# Altium project usb2can.PrjPcb
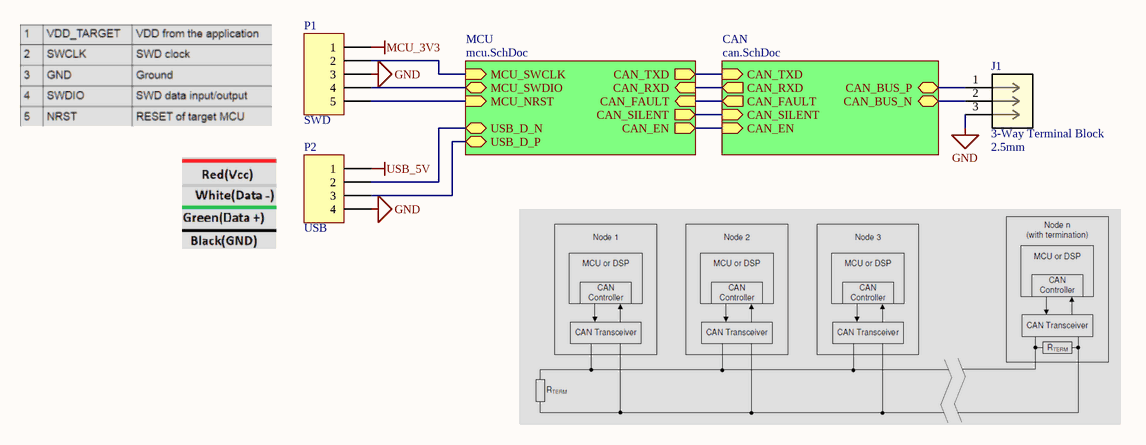
[diagram p0: top.SchDoc]
3 sheets, 36 parts. Net scope: hierarchical (ports join the sheet entries above them; power ports are global).
Board file: pcb.PcbDoc
Sheets:
  top.SchDoc
    CAN = can.SchDoc
    MCU = mcu.SchDoc

## Sheet top.SchDoc
size A4; SheetNumber: 1; SheetTotal: 3

### Parts
J1  3-Way Terminal Block  value 2.5mm  [TERMINAL_BLOCK_2.5MM_3WAY]
P1  Pin Header 5  [PIN_HEADER_1X5]  (value not drawn)
P2  Pin Header 4  [PIN_HEADER_1X4]  (value not drawn)

### Sub-sheets
CAN = can.SchDoc: CAN_TXD (in), CAN_RXD (out), CAN_FAULT (out), CAN_SILENT (in), CAN_EN (in), CAN_BUS_P (bidir), CAN_BUS_N (bidir)
MCU = mcu.SchDoc: USB_D_P (bidir), USB_D_N (bidir), MCU_SWCLK (in), MCU_SWDIO (bidir), CAN_TXD (out), CAN_SILENT (out), CAN_RXD (in), CAN_FAULT (in), CAN_EN (out), MCU_NRST (in)

### Nets
GND: J1.3 P1.3 P2.4
MCU_3V3: P1.1
USB_5V: P2.1
CAN_BUS_N: J1.2 ; sheet CAN/CAN_BUS_N
CAN_BUS_P: J1.1 ; sheet CAN/CAN_BUS_P
CAN_EN: sheet CAN/CAN_EN, sheet MCU/CAN_EN
CAN_FAULT: sheet CAN/CAN_FAULT, sheet MCU/CAN_FAULT
CAN_RXD: sheet CAN/CAN_RXD, sheet MCU/CAN_RXD
CAN_SILENT: sheet CAN/CAN_SILENT, sheet MCU/CAN_SILENT
CAN_TXD: sheet CAN/CAN_TXD, sheet MCU/CAN_TXD
NetP1_2: P1.2 ; sheet MCU/MCU_SWCLK
NetP1_4: P1.4 ; sheet MCU/MCU_SWDIO
NetP1_5: P1.5 ; sheet MCU/MCU_NRST
NetP2_2: P2.2 ; sheet MCU/USB_D_N
NetP2_3: P2.3 ; sheet MCU/USB_D_P

### Notes on the sheet
- (near P1) SWD
- (near P2) USB

### Library data of the parts
J1 = 3-Way Terminal Block: 3-way wire to board terminal block; Part Number: *; Manufacturer: *
P1 = Pin Header 5: pin header, 5-pin
P2 = Pin Header 4: pin header, 4-pin

## Sheet can.SchDoc
size A4; SheetNumber: 3; SheetTotal: 3
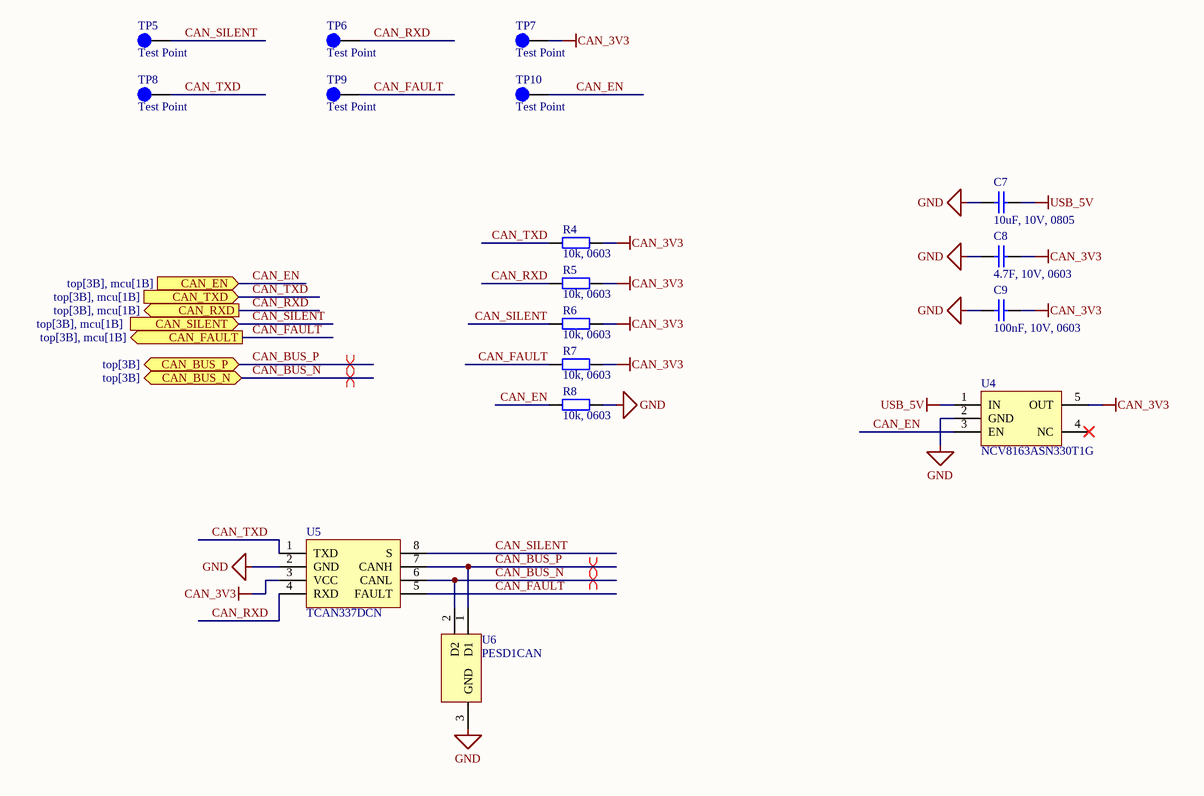
[diagram p1: can.SchDoc]

### Parts
C7  10uF, 10V, 0805  [GENERIC_MLCC_CAP_0805_IPC_MEDIUM_DENSITY]
C8  4.7F, 10V, 0603  [GENERIC_MLCC_CAP_0603_IPC_MEDIUM_DENSITY]
C9  100nF, 10V, 0603  [GENERIC_MLCC_CAP_0603_IPC_MEDIUM_DENSITY]
R4  10k, 0603  [GENERIC_CHIP_RES_0603_IPC_MEDIUM_DENSITY]
R5  10k, 0603  [GENERIC_CHIP_RES_0603_IPC_MEDIUM_DENSITY]
R6  10k, 0603  [GENERIC_CHIP_RES_0603_IPC_MEDIUM_DENSITY]
R7  10k, 0603  [GENERIC_CHIP_RES_0603_IPC_MEDIUM_DENSITY]
R8  10k, 0603  [GENERIC_CHIP_RES_0603_IPC_MEDIUM_DENSITY]
TP5  Test Point  [TEST_POINT_CIRCLE_1MM]  (no BOM)
TP6  Test Point  [TEST_POINT_CIRCLE_1MM]  (no BOM)
TP7  Test Point  [TEST_POINT_CIRCLE_1MM]  (no BOM)
TP8  Test Point  [TEST_POINT_CIRCLE_1MM]  (no BOM)
TP9  Test Point  [TEST_POINT_CIRCLE_1MM]  (no BOM)
TP10  Test Point  [TEST_POINT_CIRCLE_1MM]  (no BOM)
U4  NCV8163ASN330T1G  [NCV8163ASN330T1G_TSOP5]
U5  TCAN337DCN  [TCAN337DCN_SOT23_8]
U6  PESD1CAN  [PESD1CAN_SOT23_3]

### Ports
CAN_BUS_N (bidir, see top[3B]), CAN_BUS_P (bidir, see top[3B]), CAN_EN (in, see top[3B], mcu[1B]), CAN_FAULT (out, see top[3B], mcu[1B]), CAN_RXD (out, see top[3B], mcu[1B]), CAN_SILENT (in, see top[3B], mcu[1B]), CAN_TXD (in, see top[3B], mcu[1B])

### Nets
CAN_3V3: C8.2 C9.2 R4.2 R5.2 R6.2 R7.2 TP7.1(TP) U4.5(OUT) U5.3(VCC)
GND: C7.1 C8.1 C9.1 R8.2 U4.2(GND) U5.2(GND) U6.3(GND)
USB_5V: C7.2 U4.1(IN)
CAN_BUS_N: U5.6(CANL) U6.2(D2) ; port CAN_BUS_N
CAN_BUS_P: U5.7(CANH) U6.1(D1) ; port CAN_BUS_P
CAN_EN: R8.1 TP10.1(TP) U4.3(EN) ; port CAN_EN
CAN_FAULT: R7.1 TP9.1(TP) U5.5(FAULT) ; port CAN_FAULT
CAN_RXD: R5.1 TP6.1(TP) U5.4(RXD) ; port CAN_RXD
CAN_SILENT: R6.1 TP5.1(TP) U5.8(S) ; port CAN_SILENT
CAN_TXD: R4.1 TP8.1(TP) U5.1(TXD) ; port CAN_TXD

Not connected (* = marked no-connect by the designer): U4 4(NC)*

### Layout directives
differential pair: CAN_BUS_N, CAN_BUS_P

### Library data of the parts
C7-C9 = Generic Non-polarised Capacitor: Part Number: *; Manufacturer: *
  C7: Value: 10uF, 10V, 0805
  C8: Value: 4.7F, 10V, 0603
  C9: Value: 100nF, 10V, 0603
R4-R8 = Generic Resistor: Value: 10k, 0603; Part Number: *; Manufacturer: *
TP5-TP10 = Test Point: generic test point; Value: 1mm; Part Number: Test Point
U4 = NCV8163ASN330T1G: 3V3 250 mA LDO; Manufacturer: Onsemi; Value: 3V3, 250mA; Part Number: NCV8163ASN330T1G
U5 = TCAN337DCN: Texas Instruments 3.3-V CAN transceiver with CAN FD support. SOT-32 package.; Value: TCAN337DCN; Part Number: TCAN337DCN; Manufacturer: Texas Instruments
U6 = PESD1CAN: CAN bus ESD protection diode; Manufacturer: Nexperia; Value: PESD1CAN; Part Number: PESD1CAN

## Sheet mcu.SchDoc
size A4; SheetNumber: 2; SheetTotal: 3
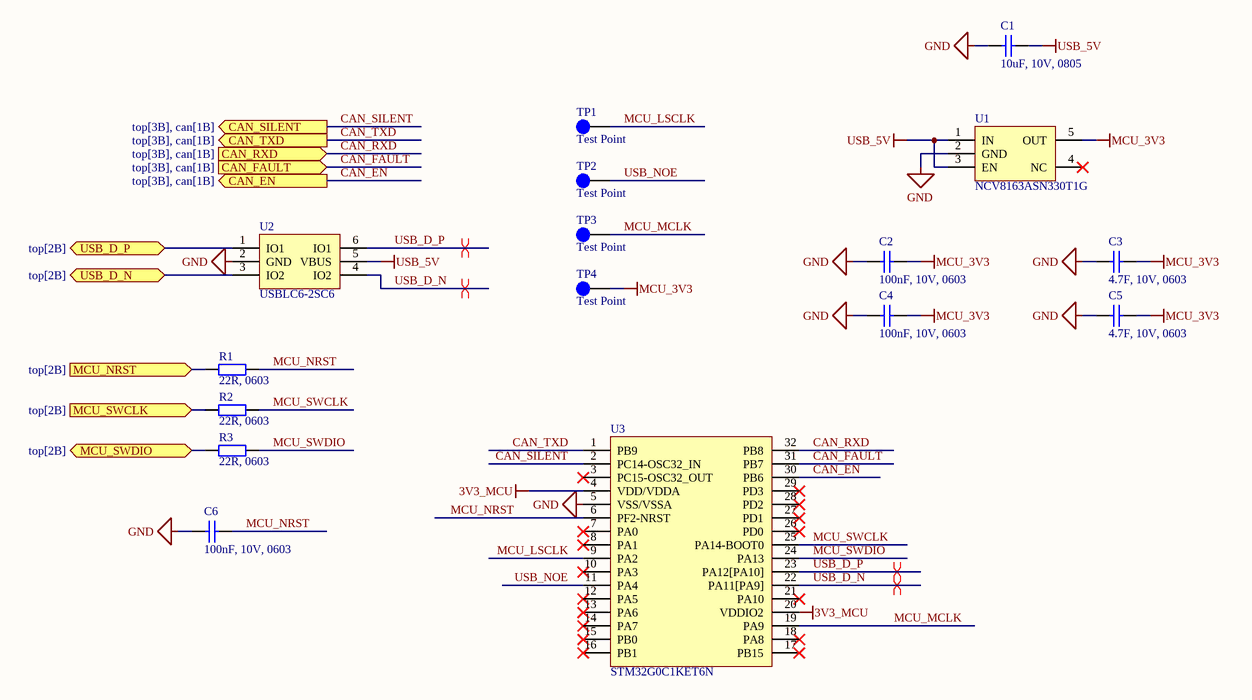
[diagram p2: mcu.SchDoc]

### Parts
C1  10uF, 10V, 0805  [GENERIC_MLCC_CAP_0805_IPC_MEDIUM_DENSITY]
C2  100nF, 10V, 0603  [GENERIC_MLCC_CAP_0603_IPC_MEDIUM_DENSITY]
C3  4.7F, 10V, 0603  [GENERIC_MLCC_CAP_0603_IPC_MEDIUM_DENSITY]
C4  100nF, 10V, 0603  [GENERIC_MLCC_CAP_0603_IPC_MEDIUM_DENSITY]
C5  4.7F, 10V, 0603  [GENERIC_MLCC_CAP_0603_IPC_MEDIUM_DENSITY]
C6  100nF, 10V, 0603  [GENERIC_MLCC_CAP_0603_IPC_MEDIUM_DENSITY]
R1  22R, 0603  [GENERIC_CHIP_RES_0603_IPC_MEDIUM_DENSITY]
R2  22R, 0603  [GENERIC_CHIP_RES_0603_IPC_MEDIUM_DENSITY]
R3  22R, 0603  [GENERIC_CHIP_RES_0603_IPC_MEDIUM_DENSITY]
TP1  Test Point  [TEST_POINT_CIRCLE_1MM]  (no BOM)
TP2  Test Point  [TEST_POINT_CIRCLE_1MM]  (no BOM)
TP3  Test Point  [TEST_POINT_CIRCLE_1MM]  (no BOM)
TP4  Test Point  [TEST_POINT_CIRCLE_1MM]  (no BOM)
U1  NCV8163ASN330T1G  [NCV8163ASN330T1G_TSOP5]
U2  USBLC6-2SC6  [USBLC6-2SC6-SOT23-6L]
U3  STM32G0C1KET6N  [STM32G0C1KET6N_LQFP32]

### Ports
CAN_EN (out, see top[3B], can[1B]), CAN_FAULT (in, see top[3B], can[1B]), CAN_RXD (in, see top[3B], can[1B]), CAN_SILENT (out, see top[3B], can[1B]), CAN_TXD (out, see top[3B], can[1B]), MCU_NRST (in, see top[2B]), MCU_SWCLK (in, see top[2B]), MCU_SWDIO (bidir, see top[2B]), USB_D_N (bidir, see top[2B]), USB_D_P (bidir, see top[2B])

### Nets
3V3_MCU: U3.4(VDD/VDDA) U3.20(VDDIO2)
GND: C1.1 C2.1 C3.1 C4.1 C5.1 C6.1 U1.2(GND) U2.2(GND) U3.5(VSS/VSSA)
MCU_3V3: C2.2 C3.2 C4.2 C5.2 TP4.1(TP) U1.5(OUT)
USB_5V: C1.2 U1.1(IN) U1.3(EN) U2.5(VBUS)
CAN_EN: U3.30(PB6) ; port CAN_EN
CAN_FAULT: U3.31(PB7) ; port CAN_FAULT
CAN_RXD: U3.32(PB8) ; port CAN_RXD
CAN_SILENT: U3.2(PC14-OSC32_IN) ; port CAN_SILENT
CAN_TXD: U3.1(PB9) ; port CAN_TXD
MCU_LSCLK: TP1.1(TP) U3.9(PA2)
MCU_MCLK: TP3.1(TP) U3.19(PA9)
MCU_NRST: C6.2 R1.2 U3.6(PF2-NRST)
MCU_SWCLK: R2.2 U3.25(PA14-BOOT0)
MCU_SWDIO: R3.2 U3.24(PA13)
USB_D_N: U2.4(IO2) U3.22(PA11[PA9])
USB_D_P: U2.6(IO1) U3.23(PA12[PA10])
USB_NOE: TP2.1(TP) U3.11(PA4)
NetP1_2: R2.1 ; port MCU_SWCLK
NetP1_4: R3.1 ; port MCU_SWDIO
NetP1_5: R1.1 ; port MCU_NRST
NetP2_2: U2.3(IO2) ; port USB_D_N
NetP2_3: U2.1(IO1) ; port USB_D_P

Not connected (* = marked no-connect by the designer): U1 4(NC)*; U3 3(PC15-OSC32_OUT)* 7(PA0)* 8(PA1)* 10(PA3)* 12(PA5)* 13(PA6)* 14(PA7)* 15(PB0)* 16(PB1)* 17(PB15)* 18(PA8)* 21(PA10)* 26(PD0)* 27(PD1)* 28(PD2)* 29(PD3)*

### Layout directives
differential pair: USB_D_N, USB_D_P

### Library data of the parts
C1-C6 = Generic Non-polarised Capacitor: Part Number: *; Manufacturer: *
  C1: Value: 10uF, 10V, 0805
  C2 C4 C6: Value: 100nF, 10V, 0603
  C3 C5: Value: 4.7F, 10V, 0603
R1-R3 = Generic Resistor: Value: 22R, 0603; Part Number: *; Manufacturer: *
TP1-TP4 = Test Point: generic test point; Value: 1mm; Part Number: Test Point
U1 = NCV8163ASN330T1G: as U4 on sheet can; Part Number: NCV8163ASN330T1G
U2 = USBLC6-2SC6: Very low capacitance ESD protection for the USB bus.; Manufacturer: ST; Value: USBLC6-2SC6; Part Number: USBLC6-2SC6
U3 = STM32G0C1KET6N: STM32G0, Arm® Cortex®-M0+ 32-bit MCU, 512KB Flash, 144KB RAM, LQFP32; Manufacturer: ST; Value: STM32G0C1KET6N; Part Number: STM32G0C1KET6N

## Nets that join several sheets
GND: top (J1.3 P1.3 P2.4), can (7 pins), mcu (9 pins)
MCU_3V3: top (P1.1), mcu (6 pins)
USB_5V: top (P2.1), can (C7.2 U4.1), mcu (C1.2 U1.1 U1.3 U2.5)
CAN_BUS_N: top (J1.2), can (U5.6 U6.2)
CAN_BUS_P: top (J1.1), can (U5.7 U6.1)
CAN_EN: can (R8.1 TP10.1 U4.3), mcu (U3.30)
CAN_FAULT: can (R7.1 TP9.1 U5.5), mcu (U3.31)
CAN_RXD: can (R5.1 TP6.1 U5.4), mcu (U3.32)
CAN_SILENT: can (R6.1 TP5.1 U5.8), mcu (U3.2)
CAN_TXD: can (R4.1 TP8.1 U5.1), mcu (U3.1)
NetP1_2: top (P1.2), mcu (R2.1)
NetP1_4: top (P1.4), mcu (R3.1)
NetP1_5: top (P1.5), mcu (R1.1)
NetP2_2: top (P2.2), mcu (U2.3)
NetP2_3: top (P2.3), mcu (U2.1)